# Altium project system-schematic.PrjPcb
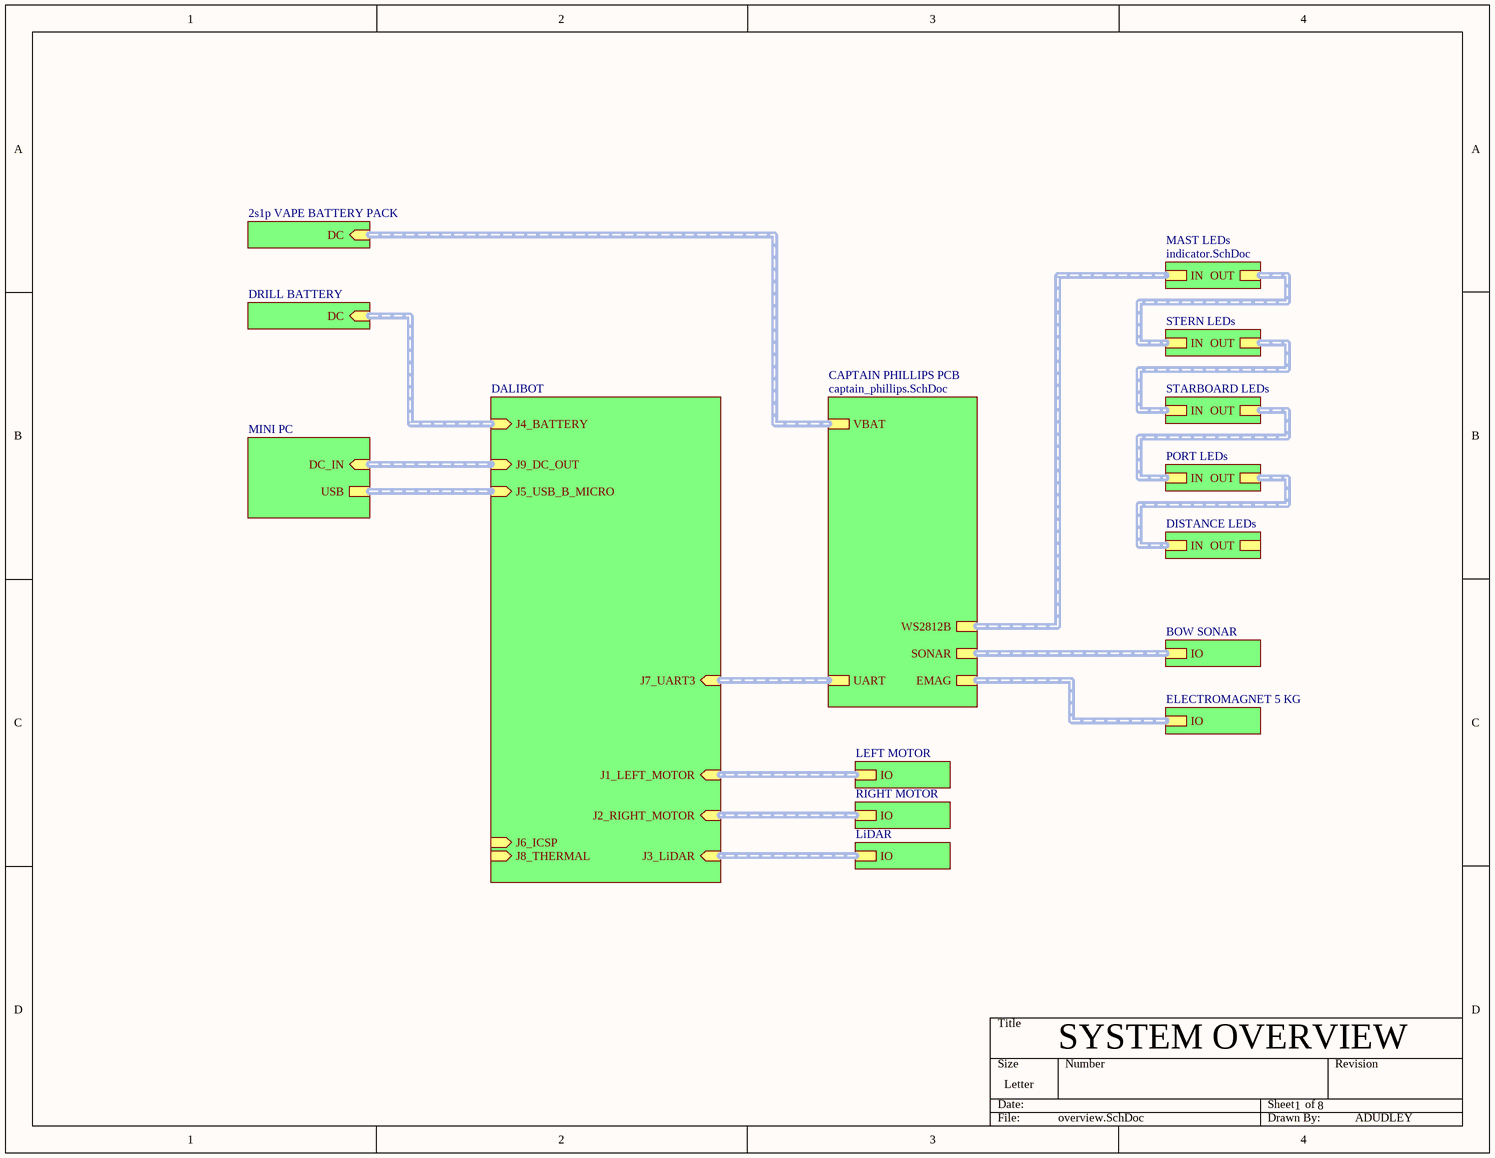
[diagram p0: overview.SchDoc]
8 sheets, 73 parts. Net scope: hierarchical (ports join the sheet entries above them; power ports are global).
Sheets:
  overview.SchDoc
    MAST LEDs = indicator.SchDoc
    PORT LEDs = indicator.SchDoc
    STERN LEDs = indicator.SchDoc
    STARBOARD LEDs = indicator.SchDoc
    CAPTAIN PHILLIPS PCB = captain_phillips.SchDoc
      PSU = power_supply.SchDoc
      MICROCONTROLLER = microcontroller.SchDoc
      EMAG CONTROL = emag.SchDoc
      WS2812B CONTROL = ws2812b.SchDoc
      SONAR CONTROL = sonar.SchDoc
    DISTANCE LEDs = indicator.SchDoc

## Sheet overview.SchDoc
size Letter; SheetNumber: 1; SheetTotal: 8

### Sub-sheets
2s1p VAPE BATTERY PACK = File Name (file not in this document): DC (in)
BOW SONAR = File Name (file not in this document): IO
CAPTAIN PHILLIPS PCB = captain_phillips.SchDoc: SONAR, UART, WS2812B, EMAG, VBAT
DALIBOT = File Name (file not in this document): J1_LEFT_MOTOR (in), J2_RIGHT_MOTOR (in), J3_LiDAR (in), J4_BATTERY (in), J5_USB_B_MICRO (in), J6_ICSP (in), J7_UART3 (in), J8_THERMAL (in), J9_DC_OUT (in)
DISTANCE LEDs = indicator.SchDoc: OUT, IN
DRILL BATTERY = File Name (file not in this document): DC (in)
ELECTROMAGNET 5 KG = File Name (file not in this document): IO
LEFT MOTOR = File Name (file not in this document): IO
LiDAR = File Name (file not in this document): IO
MAST LEDs = indicator.SchDoc: IN, OUT
MINI PC = File Name (file not in this document): USB, DC_IN (in)
PORT LEDs = indicator.SchDoc: OUT, IN
RIGHT MOTOR = File Name (file not in this document): IO
STARBOARD LEDs = indicator.SchDoc: OUT, IN
STERN LEDs = indicator.SchDoc: OUT, IN

### Buses and harness runs
harness sheet 2s1p VAPE BATTERY PACK/DC = sheet CAPTAIN PHILLIPS PCB/VBAT
harness sheet BOW SONAR/IO = sheet CAPTAIN PHILLIPS PCB/SONAR
harness sheet CAPTAIN PHILLIPS PCB/EMAG = sheet ELECTROMAGNET 5 KG/IO
harness sheet CAPTAIN PHILLIPS PCB/UART = sheet DALIBOT/J7_UART3
harness sheet CAPTAIN PHILLIPS PCB/WS2812B = sheet MAST LEDs/IN
harness sheet DALIBOT/J1_LEFT_MOTOR = sheet LEFT MOTOR/IO
harness sheet DALIBOT/J2_RIGHT_MOTOR = sheet RIGHT MOTOR/IO
harness sheet DALIBOT/J3_LiDAR = sheet LiDAR/IO
harness sheet DALIBOT/J4_BATTERY = sheet DRILL BATTERY/DC
harness sheet DALIBOT/J5_USB_B_MICRO = sheet MINI PC/USB
harness sheet DALIBOT/J9_DC_OUT = sheet MINI PC/DC_IN
harness sheet DISTANCE LEDs/IN = sheet PORT LEDs/OUT
harness sheet MAST LEDs/OUT = sheet STERN LEDs/IN
harness sheet PORT LEDs/IN = sheet STARBOARD LEDs/OUT
harness sheet STARBOARD LEDs/IN = sheet STERN LEDs/OUT

### Notes on the sheet
- SYSTEM OVERVIEW
- ADUDLEY

## Sheet indicator.SchDoc
size Letter; SheetNumber: 8; SheetTotal: 8
Used 5 times, as channels MAST LEDs, PORT LEDs, STERN LEDs, STARBOARD LEDs, DISTANCE LEDs. Parts and nets are listed once, with the designators drawn on the sheet.
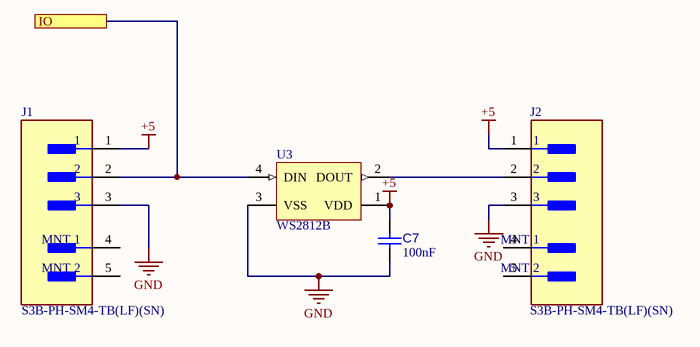
[diagram p1: indicator.SchDoc]

### Parts
C7  value 100nF  [3]  (hidden comment: Capacitor 100 nF 10 % 50V 0603)
J1  S3B-PH-SM4-TB(LF)(SN)  [FP-S3B-PH-SM4-TB_LF_SN-MFG]
J2  S3B-PH-SM4-TB(LF)(SN)  [FP-S3B-PH-SM4-TB_LF_SN-MFG]
U3  WS2812B  [ADAI-WS2812B_V]

### Ports
IO

### Nets
+5: C7.2 J1.1 J2.1 U3.1(VDD)
GND: C7.1 J1.3 J2.3 U3.3(VSS)
IO: J1.2 U3.4(DIN) ; port IO
NetJ2_2: J2.2 U3.2(DOUT)

Not connected (* = marked no-connect by the designer): J1 4(MNT_1) 5(MNT_2); J2 4(MNT_1) 5(MNT_2)

### Channels
MAST LEDs: designators end in _MAST_LEDs; ports IO=NetJ1_MAST_LEDs_2
PORT LEDs: designators end in _PORT_LEDs; ports IO=NetJ1_PORT_LEDs_2
STERN LEDs: designators end in _STERN_LEDs; ports IO=NetJ1_STERN_LEDs_2
STARBOARD LEDs: designators end in _STARBOARD_LEDs; ports IO=NetJ1_STARBOARD_LEDs_2
DISTANCE LEDs: designators end in _DISTANCE_LEDs; ports IO=NetJ1_DISTANCE_LEDs_2

### Library data of the parts
C7 = CMP-001-00092-5: CAP CER 100 nF 50V X7R 0603; Capacitor Type: Ceramic; Tolerance: 10%; Voltage Rating: 50V; Case/Package: 0603; LCSC Part Number: C14663
J1 J2 = CMP-2000-07023-2: CONN HEADER SMD R/A 3POS 2MM; Voltage Rating: 100V; Gender: Male; Max Current Rating: 2A; Number of Contacts: 3; Insulation Resistance: 1GR; Contact Resistance: 10mR; Termination: Solder; Orientation: Right Angle; Insulation Color: Natural; Flammability Rating: UL94 V-0; Width: 5mm; Lead Free: Lead Free; Mount: Surface Mount; Max Operating Temperature: 85°C; Connector Type: Header; Fastening Type: Detent; Max Voltage Rating (DC): 100V; Housing Material: Polyamide; Number of Rows: 1; Housing Color: Beige; Contact Plating: Tin; Contact Shape: Square; Working Voltage: 100V; Contact Material: Copper Alloy; Contact Mating Length: 0.13inch; Contact Type: Male Pin; Max Voltage Rating (AC): 100V; Packaging: Tape and Reel; Min Operating Temperature: -25°C; Number of Positions: 3; REACH SVHC: No SVHC; Contact Finish - Mating: TIN; Color: Natural; Length: 9.9mm; Insulation Material: Nylon; Depth: 7.6mm; Current Rating: 2A; Material: Polyamide; Voltage Rating (AC): 100V; Pitch: 2mm; Series: PH; Height: 9.4mm; Number of Poles: 3; Lead Pitch: 2mm
U3 = CMP-007-00035-2: Intelligent Control LED Integrated Light Source, 3.5 to 5.3 V, -25 to 80 degC, 4-Pin SMD, RoHS, Bulk; Manufacturer: Adafruit Industries; Datasheet URL: https://cdn-shop.adafruit.com/datasheets/WS2812B.pdf; Manufacturer URL: https://www.adafruit.com/; Datasheet Version: May-13; Case/Package: WS2812B; Mounting Technology: SM; RoHS Compliant: False; Package Description: 4-Pin Surface Mount Device, Body 5 x 5 mm, Pitch 3.3 mm; Package Reference: WS2812B

## Sheet captain_phillips.SchDoc
size Letter; SheetNumber: 2; SheetTotal: 8
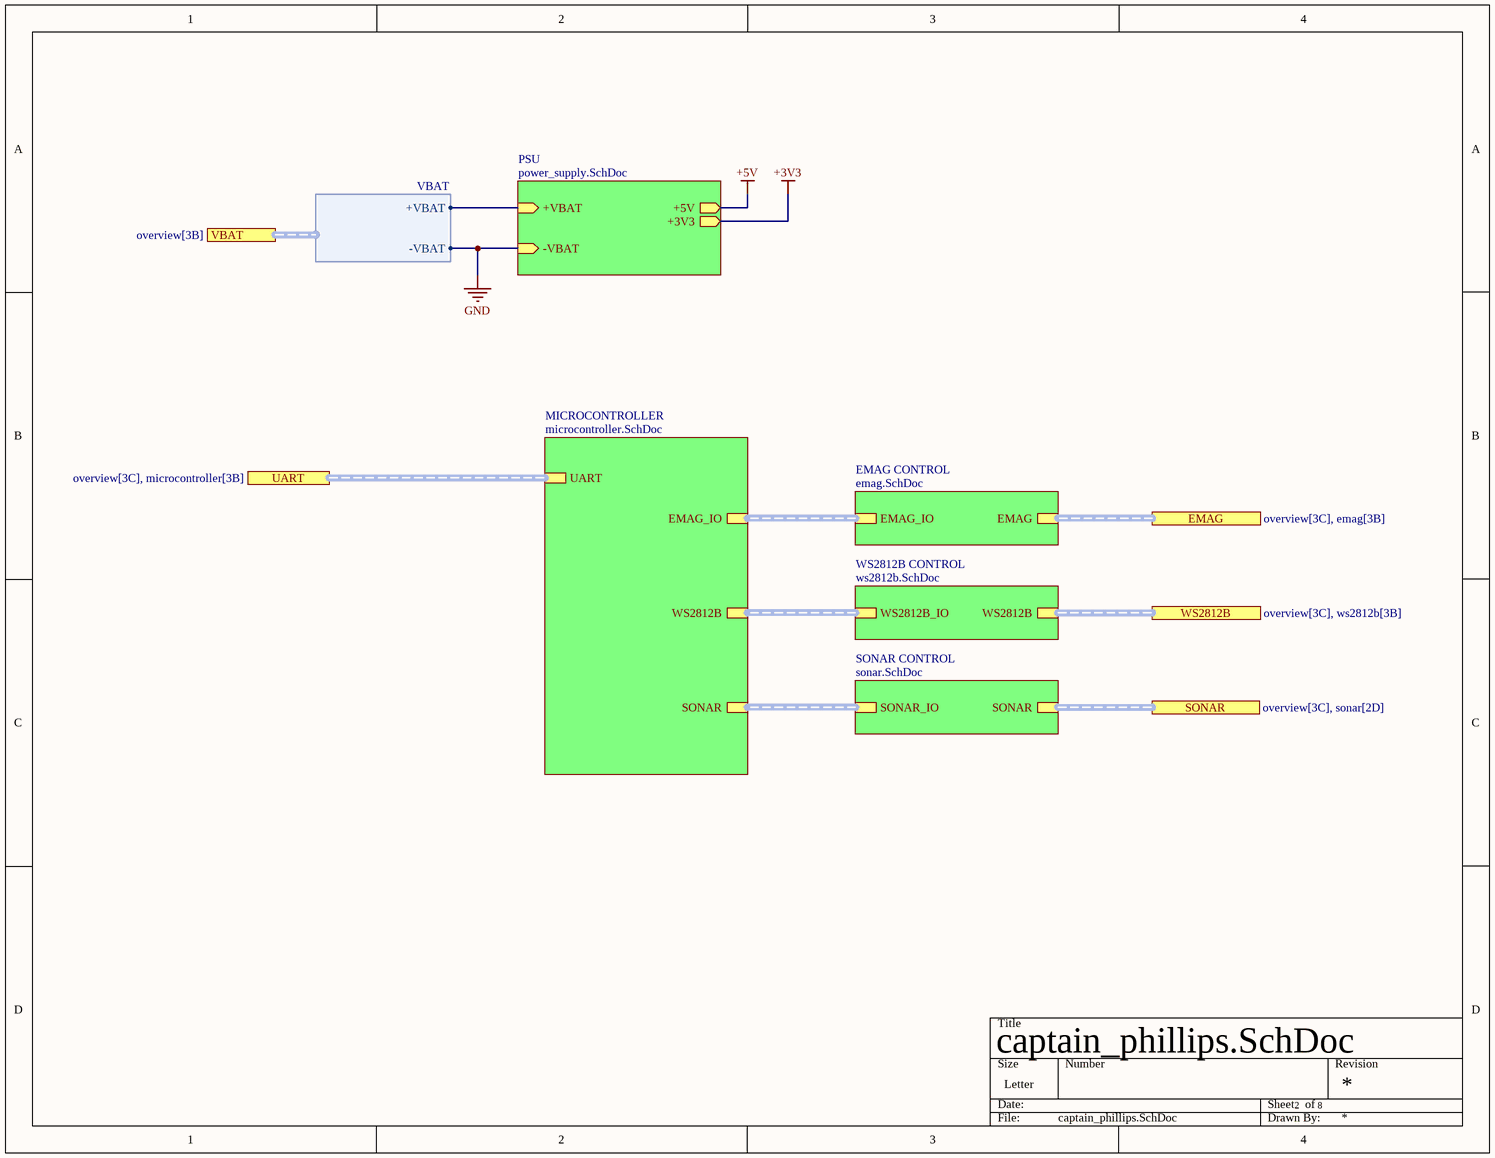
[diagram p2: captain_phillips.SchDoc]

### Sub-sheets
EMAG CONTROL = emag.SchDoc: EMAG, EMAG_IO
MICROCONTROLLER = microcontroller.SchDoc: UART, SONAR, WS2812B, EMAG_IO
PSU = power_supply.SchDoc: +VBAT (in), -VBAT (in), +5V (out), +3V3 (out)
SONAR CONTROL = sonar.SchDoc: SONAR_IO, SONAR
WS2812B CONTROL = ws2812b.SchDoc: WS2812B_IO, WS2812B

### Ports
EMAG (see overview[3C], emag[3B]), SONAR (see overview[3C], sonar[2D]), UART (see overview[3C], microcontroller[3B]), VBAT (harness VBAT, see overview[3B]), WS2812B (see overview[3C], ws2812b[3B])

### Harnesses
VBAT: +VBAT, -VBAT

### Nets
GND: sheet PSU/-VBAT, port VBAT.-VBAT
NetC?#2_2: sheet PSU/+VBAT, port VBAT.+VBAT

### Buses and harness runs
harness port EMAG = sheet EMAG CONTROL/EMAG
harness port SONAR = sheet SONAR CONTROL/SONAR
harness port UART = sheet MICROCONTROLLER/UART
harness port WS2812B = sheet WS2812B CONTROL/WS2812B
harness sheet EMAG CONTROL/EMAG_IO = sheet MICROCONTROLLER/EMAG_IO
harness sheet MICROCONTROLLER/SONAR = sheet SONAR CONTROL/SONAR_IO
harness sheet MICROCONTROLLER/WS2812B = sheet WS2812B CONTROL/WS2812B_IO

## Sheet power_supply.SchDoc
size Letter; SheetNumber: 3; SheetTotal: 8
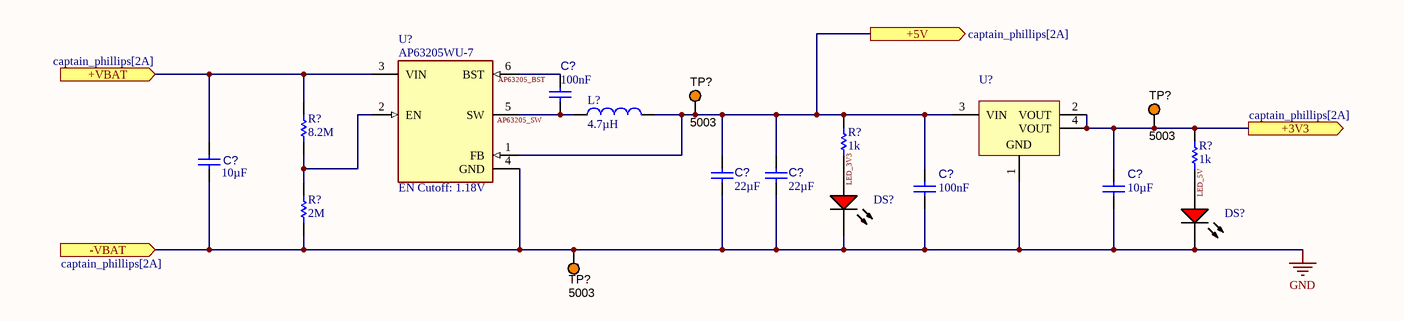
[diagram p3: power_supply.SchDoc]

### Parts
(Parts that share a designator on the sheet are numbered #1, #2 ... from top to bottom, then left to right.)
C?#1  value 100nF  [CAPC1005X05M]  (hidden comment: Capacitor 100nF 10 % 50V 0402)
C?#2  value 10µF  [3]  (hidden comment: Capacitor 10 uF 20 % 25V 0603)
C?#3  value 22µF  [3]  (hidden comment: Capacitor 22 uF 20 % 10V 0603)
C?#4  value 22µF  [3]  (hidden comment: Capacitor 22 uF 20 % 10V 0603)
C?#5  value 100nF  [3]  (hidden comment: Capacitor 100 nF 10 % 50V 0603)
C?#6  value 10µF  [3]  (hidden comment: Capacitor 10 uF 20 % 25V 0603)
DS?#1  19-217/R6C-AL1M2VY/3T  [EVRL-0603-2_V]  (value not drawn)
DS?#2  19-217/R6C-AL1M2VY/3T  [EVRL-0603-2_V]  (value not drawn)
L?  value 4.7µH  [FP-SPM6530-0]  (hidden comment: SPM6530T-4R7M-HZ)
R?#1  value 1k  [RESC1608X55X25ML10T15]  (hidden comment: 1K 1% 0603)
R?#2  value 8.2M  [RESC1608X55X25ML10T15]  (hidden comment: 8M2 1 0603)
R?#3  value 1k  [RESC1608X55X25ML10T15]  (hidden comment: 1K 1% 0603)
R?#4  value 2M  [RESC1608X55X25ML10T15]  (hidden comment: 2M 1 0603)
TP?#1  5003  [KSTN-5003]
TP?#2  5003  [KSTN-5003]
TP?#3  5003  [KSTN-5003]
U?#1  AP63205WU-7  [FP-TSOT26-MFG]
U?#2  LDL1117S33R  [STM-SOT-223_M]  (value not drawn)

### Ports
+3V3 (out, see captain_phillips[2A]), +5V (out, see captain_phillips[2A]), +VBAT (in, see captain_phillips[2A]), -VBAT (in, see captain_phillips[2A])

### Nets
+3V3: C?#6.2 R?#3.1 TP?#2.1 U?#2.2(VOUT) U?#2.4(VOUT) ; port +3V3
+5V: C?#3.2 C?#4.2 C?#5.2 L?.2 R?#1.1 TP?#1.1 U?#1.1(FB) U?#2.3(VIN) ; port +5V
GND: C?#2.1 C?#3.1 C?#4.1 C?#5.1 C?#6.1 DS?#1.2(K) DS?#2.2(K) R?#4.1 TP?#3.1 U?#1.4(GND) U?#2.1(GND) ; port -VBAT
AP63205_BST: C?#1.2 U?#1.6(BST)
AP63205_SW: C?#1.1 L?.1 U?#1.5(SW)
LED_3V3: DS?#1.1(A) R?#1.2
LED_5V: DS?#2.1(A) R?#3.2
NetC?#2_2: C?#2.2 R?#2.2 U?#1.3(VIN) ; port +VBAT
NetR?#2_1: R?#2.1 R?#4.2 U?#1.2(EN)

### Notes on the sheet
- (near U?#1) EN Cutoff: 1.18V

### Library data of the parts
C?#1 = CMP-001-00135-7: CAP CER 100nF 25V X7R 0402; Tolerance: 10%; Capacitor Type: Ceramic; Voltage Rating: 25V; Mounting Technology: Surface Mount; Case/Package: 0402; Max Operating Temperature: 125°C; RoHS Compliant: Yes; Min Operating Temperature: -55°C; Pins: 2; LCSC Part Number: C307331
C?#2 C?#6 = CMP-001-00101-3: CAP CER 10UF 25V X5R 0603; Capacitor Type: Ceramic; Tolerance: 20%; Case/Package: 0603; Voltage Rating: 25V; LCSC Part Number: C96446
C?#3 C?#4 = CMP-001-00128-4: CAP CER 22UF 10V X5R 0603; Tolerance: 20%; Capacitor Type: Ceramic; Mounting Technology: Surface Mount; Voltage Rating: 10V; Max Operating Temperature: 85°C; Min Operating Temperature: -55°C; Pins: 2; RoHS Compliant: Yes; Case/Package: 0603; LCSC Part Number: C59461
C?#5 = CMP-001-00092-5: CAP CER 100 nF 50V X7R 0603; Tolerance: 10%; Capacitor Type: Ceramic; Voltage Rating: 50V; Case/Package: 0603; LCSC Part Number: C14663
DS?#1 DS?#2 = CMP-007-00004-3: Chip LED, Red, 5 V, 25 mA, -40 to 85 degC, 2-Pin SMD (0603), RoHS, Tape and Reel; Manufacturer: Everlight Electronics; Forward Voltage: 2.2V; Lens Style: Clear; Package Reference: 0603; Datasheet Version: Rev. 1, 01/2005; Mounting Technology: SM; RoHS Compliant: False; Datasheet URL: https://datasheet.ciiva.com/4688/el-19-217-r6c-al1m2vy-3tpdf-187026-4688713.pdf; Case/Package: 0603; Colour: Red; Manufacturer URL: http://www.everlight.com/; Package Description: 2-Pin Surface Mount Device, Body 1.6 x 0.8 mm; LCSC Part Number: C2286
L? = CMP-006-00027-2: General Purpose Inductor, 4.7uH, 20%, 1 Element, Metal-Core, SMD, 2826; Max Current Rating: 5.6A; RoHS Compliant: Yes; Case/Package: SPM6530T-4R7M-HZ; Inductor Type: GENERAL PURPOSE INDUCTOR; LCSC Part Number: C360729
R?#1 R?#3 = CMP-0103-0583-9: 0603 (1608 Metric) 1/10 W 1K 1% Thick Film Chip Resistor; Case-Metric: 1608; Power: 100mW; Case-EIA: 0603; Temp. Coefficent: ±100; Technology: SMT; Tolerance: 1%; Case/Package: 0603; LCSC Part Number: C21190
R?#2 = CMP-0103-0677-7: 0603 (1608 Metric) 1/10 W 8M2 1 Thick Film Chip Resistor; Power: 100mW; Temp. Coefficent: ±100; Tolerance: 1%; Case-Metric: 1608; Case-EIA: 0603; Technology: SMT
R?#4 = CMP-0103-0662-7: 0603 (1608 Metric) 1/10 W 2M 1 Thick Film Chip Resistor; Case-Metric: 1608; Case-EIA: 0603; Power: 100mW; Tolerance: 1%; Temp. Coefficent: ±100; Technology: SMT
TP?#1-TP?#3 = CMP-002-00037-3: Test Point, Orange, Height 4.6 mm, Tail Length 3 mm, 1-Pin THD, RoHS; Manufacturer: Keystone; Case/Package: 5003; RoHS Compliant: True; Mounting Technology: TH; Connector Type: TestPoint; Pins: 1; Colour: Orange; Packaging: Bulk; Package Description: 1-Pin Through Hole Device, Dia 2.54 mm; Package Reference: 5003; Datasheet Version: Jun-15; Diameter: 2.54mm; Contact Material: Bronze; Datasheet URL: http://keyelco.com/userAssets/file/M65p56.pdf; Manufacturer URL: http://www.keyelco.com/; Package Quantity: 10; Contact Plating: Tin; LCSC Part Number: C238122
U?#1 = CMP-019-00057-2: Switching Regulator; LCSC Part Number: C2071056
U?#2 = CMP-019-00076-2: Fixed Positive LDO Regulator, 3.3V, 0.6V Dropout, PDSO4; Manufacturer: STMicroelectronics; Output Current: 950mA; Output Voltage1-Max: 3.399V; Output Current1-Max: 1.2A; Number of Outputs: 1; Max Input Voltage: 15V; Time @ Peak Reflow Temperature-Max (s): 30s; Min Input Voltage: 4.3V; Max Supply Voltage: 18V; Dropout Voltage1-Nom: 1.1V; Power: 12W; Output Voltage1-Min: 3.201V; Max Ouput Current: 1.3A; Regulator Type: FIXED POSITIVE SINGLE OUTPUT LDO REGULATOR; Qualification Status: Not Qualified; Dropout Voltage1-Max: 600mV; Min Supply Voltage: 4.75V; Voltage Tolerance-Max: 2%; Package Body Material: Plastic; Technology: BIPOLAR; Mounting Technology: SM; Reach SVHC Compliant: Yes; Package Quantity: 2500; Channels: 1; Max Operating Temperature: 125°C; Output Voltage: 3.3V; Terminal Finish: Tin; Terminal Pitch: 2.3mm; Operating Temperature, TJ-Min: -40°C; Surface Mount: Yes; Moisture Sensitivity Level: 1; Peak Reflow Temperature (Cel): 260°C; Datasheet URL: http://www.farnell.com/datasheets/1776449.pdf; RoHS Compliant: Yes; Terminal Form: Gull Wing; Width: 3.5mm; Height - Seated (Max): 1.9mm; Operating Temperature, TJ-Max: 125°C; Length: 6.5mm; Package Description: 4-Pin Small Outline Transistor, Body 6.5 x 3.5 mm, Pitch 2.3 mm; Output Voltage1-Nom: 3.3V; Package Style: SMALL OUTLINEMeter; Dropout Voltage: 1.1V; Outputs: 1; JESD-609 Code: e3; Manufacturer URL: http://www.st.com/; Datasheet Version: Rev. 33, 11/2013; Package Shape: Rectangular; Package Reference: SOT-223; JESD-30 Code: R-PDSO-G4; Packaging: Tape and Reel; Input Voltage Absolute-Max: 15V; Pins: 4; Adjustability: FIXED; Nominal Output Voltage: 3.3V; Min Operating Temperature: 0°C; Case/Package: SOP; Terminal Position: DUAL; LCSC Part Number: C435835

## Sheet microcontroller.SchDoc
size Letter; SheetNumber: 7; SheetTotal: 8
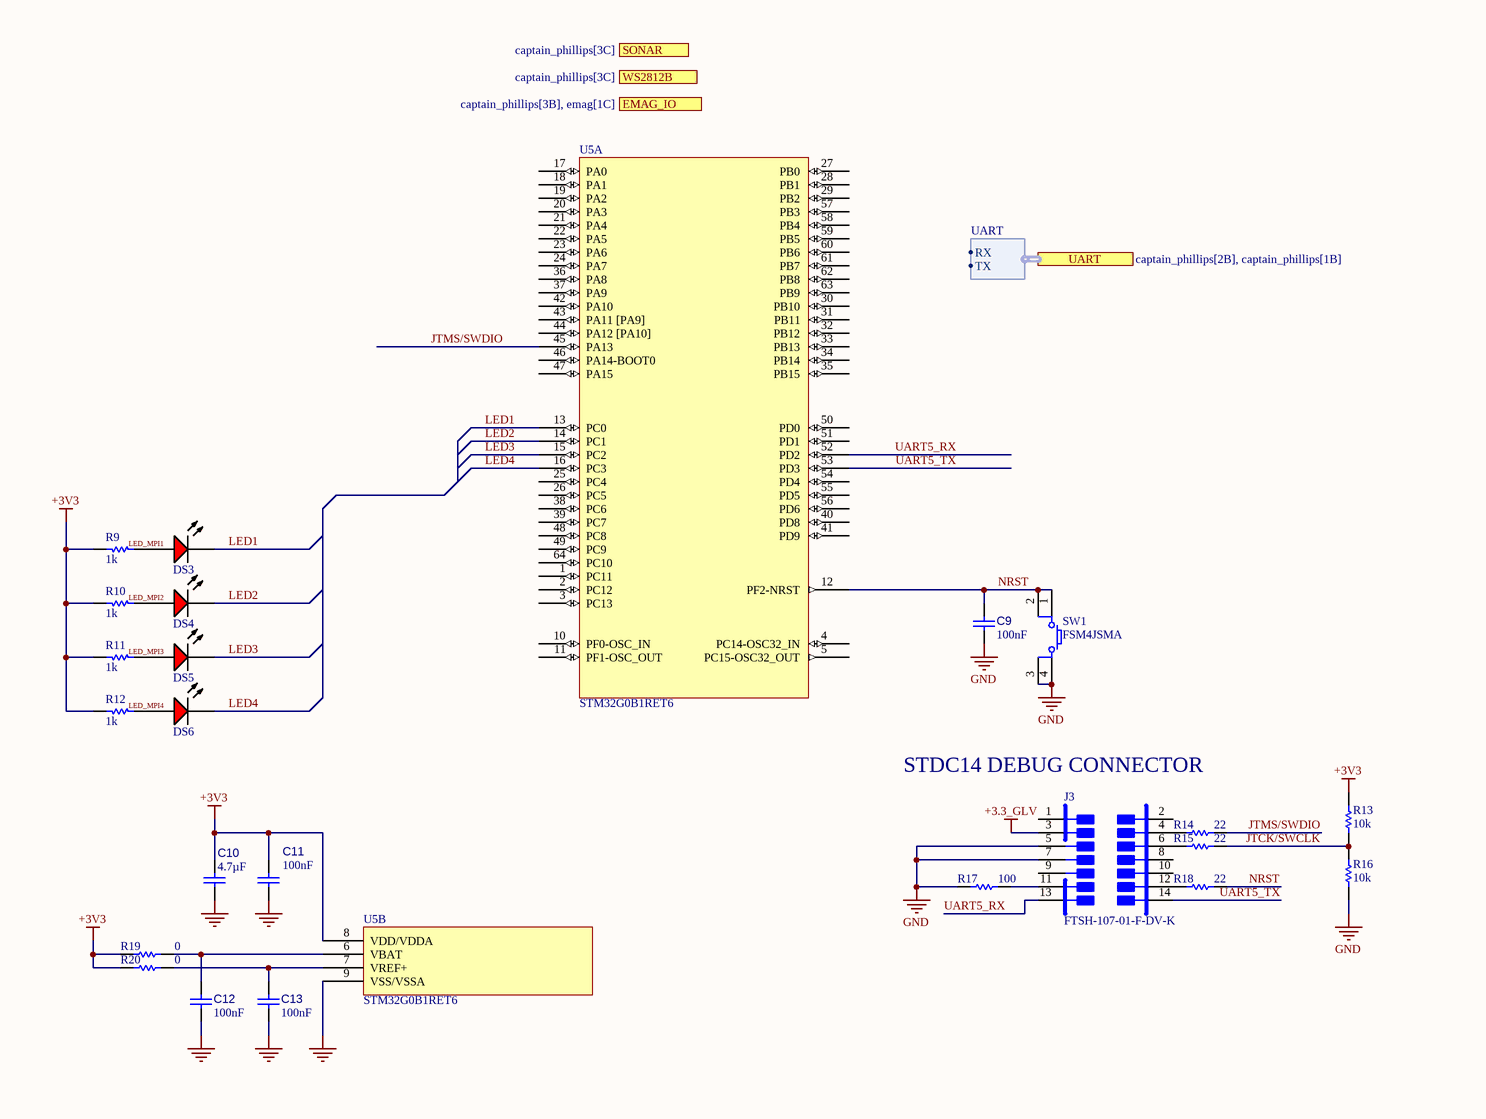
[diagram p4: microcontroller.SchDoc, left]
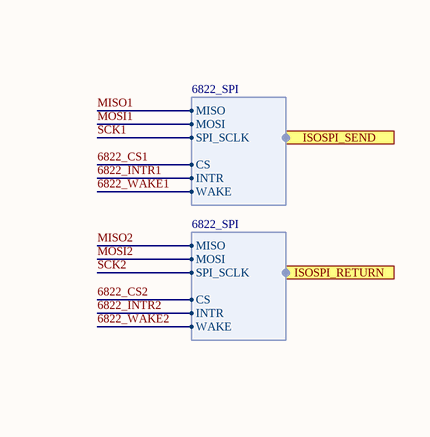
[diagram p5: microcontroller.SchDoc, right]

### Parts
C9  value 100nF  [CAPC1005X05M]  (hidden comment: Capacitor 100nF 10 % 50V 0402)
C10  value 4.7µF  [CAPC1005X05M]  (hidden comment: Capacitor 4.7uF 20 % 10V 0402)
C11  value 100nF  [CAPC1005X05M]  (hidden comment: Capacitor 100nF 10 % 50V 0402)
C12  value 100nF  [CAPC1005X05M]  (hidden comment: Capacitor 100nF 10 % 50V 0402)
C13  value 100nF  [CAPC1005X05M]  (hidden comment: Capacitor 100nF 10 % 50V 0402)
DS3  19-217/R6C-AL1M2VY/3T  [EVRL-0603-2_V]  (value not drawn)
DS4  19-217/R6C-AL1M2VY/3T  [EVRL-0603-2_V]  (value not drawn)
DS5  19-217/R6C-AL1M2VY/3T  [EVRL-0603-2_V]  (value not drawn)
DS6  19-217/R6C-AL1M2VY/3T  [EVRL-0603-2_V]  (value not drawn)
J3  FTSH-107-01-F-DV-K  [FP-FTSH-107-01-F-DV-K-MFG]
R9  value 1k  [RESC1608X55X25ML10T15]  (hidden comment: 1K 1% 0603)
R10  value 1k  [RESC1608X55X25ML10T15]  (hidden comment: 1K 1% 0603)
R11  value 1k  [RESC1608X55X25ML10T15]  (hidden comment: 1K 1% 0603)
R12  value 1k  [RESC1608X55X25ML10T15]  (hidden comment: 1K 1% 0603)
R13  value 10k  [RESC1608X55X25ML10T15]  (hidden comment: 10K 1 0603)
R14  value 22  [RESC1608X55X25ML10T15]  (hidden comment: 22R 1% 0603)
R15  value 22  [RESC1608X55X25ML10T15]  (hidden comment: 22R 1% 0603)
R16  value 10k  [RESC1608X55X25ML10T15]  (hidden comment: 10K 1 0603)
R17  value 100  [RESC1608X55X25ML10T15]  (hidden comment: 100R 1 0603)
R18  value 22  [RESC1608X55X25ML10T15]  (hidden comment: 22R 1% 0603)
R19  value 0  [RESC1608X55X25ML10T15]  (hidden comment: Jumper 0603)
R20  value 0  [RESC1608X55X25ML10T15]  (hidden comment: Jumper 0603)
SW1  FSM4JSMA  [TECO-FSM4JSMA_V]
U5  STM32G0B1RET6  [STM32G0B1RET6-Footprint-1]  (parts A,B of 2)

### Ports
EMAG_IO (see captain_phillips[3B], emag[1C]), ISOSPI_RETURN (harness 6822_SPI), ISOSPI_SEND (harness 6822_SPI), SONAR (see captain_phillips[3C]), UART (harness UART, see captain_phillips[2B], captain_phillips[1B]), WS2812B (see captain_phillips[3C])

### Harnesses
UART: RX, TX
6822_SPI: MISO, MOSI, SPI_SCLK, CS, INTR, WAKE

### Nets
+3.3_GLV: J3.3
+3V3: C10.2 C11.1 R9.2 R10.2 R11.2 R12.2 R13.2 R19.1 R20.1 U5.8(VDD/VDDA)
GND: C9.1 C10.1 C11.2 C12.2 C13.2 J3.5 J3.7 R16.1 R17.1 SW1.3 SW1.4 U5.9(VSS/VSSA)
6822_CS1: port ISOSPI_SEND.CS
6822_CS2: port ISOSPI_RETURN.CS
6822_INTR1: port ISOSPI_SEND.INTR
6822_INTR2: port ISOSPI_RETURN.INTR
6822_WAKE1: port ISOSPI_SEND.WAKE
6822_WAKE2: port ISOSPI_RETURN.WAKE
JTCK/SWCLK: R13.1 R15.2 R16.2
JTMS/SWDIO: R14.2 U5.45(PA13)
LED1: DS3.2(K) U5.13(PC0)
LED2: DS4.2(K) U5.14(PC1)
LED3: DS5.2(K) U5.15(PC2)
LED4: DS6.2(K) U5.16(PC3)
LED_MPI1: DS3.1(A) R9.1
LED_MPI2: DS4.1(A) R10.1
LED_MPI3: DS5.1(A) R11.1
LED_MPI4: DS6.1(A) R12.1
MISO1: port ISOSPI_SEND.MISO
MISO2: port ISOSPI_RETURN.MISO
MOSI1: port ISOSPI_SEND.MOSI
MOSI2: port ISOSPI_RETURN.MOSI
NRST: C9.2 R18.2 SW1.1 SW1.2 U5.12(PF2-NRST)
SCK1: port ISOSPI_SEND.SPI_SCLK
SCK2: port ISOSPI_RETURN.SPI_SCLK
UART5_RX: J3.13 U5.52(PD2)
UART5_TX: J3.14 U5.53(PD3)
NetC12_1: C12.1 R19.2 U5.6(VBAT)
NetC13_1: C13.1 R20.2 U5.7(VREF+)
NetJ3_4: J3.4 R14.1
NetJ3_6: J3.6 R15.1
NetJ3_11: J3.11 R17.2
NetJ3_12: J3.12 R18.1

Not connected (* = marked no-connect by the designer): J3 1 2 8 9 10; U5 1(PC11) 2(PC12) 3(PC13) 4(PC14-OSC32_IN) 5(PC15-OSC32_OUT) 10(PF0-OSC_IN) 11(PF1-OSC_OUT) 17(PA0) 18(PA1) 19(PA2) 20(PA3) 21(PA4) 22(PA5) 23(PA6) 24(PA7) 25(PC4) 26(PC5) 27(PB0) 28(PB1) 29(PB2) 30(PB10) 31(PB11) 32(PB12) 33(PB13) 34(PB14) 35(PB15) 36(PA8) 37(PA9) 38(PC6) 39(PC7) 40(PD8) 41(PD9) 42(PA10) 43(PA11_[PA9]) 44(PA12_[PA10]) 46(PA14-BOOT0) 47(PA15) 48(PC8) 49(PC9) 50(PD0) 51(PD1) 54(PD4) 55(PD5) 56(PD6) 57(PB3) 58(PB4) 59(PB5) 60(PB6) 61(PB7) 62(PB8) 63(PB9) 64(PC10)

### Notes on the sheet
- (near J3) STDC14 DEBUG CONNECTOR

### Library data of the parts
C9 C11-C13 = CMP-001-00135-7: as C?#1 on sheet power_supply; Case/Package: 0402; Pins: 2; Min Operating Temperature: -55°C; RoHS Compliant: Yes; Mounting Technology: Surface Mount; Max Operating Temperature: 125°C; Voltage Rating: 25V; LCSC Part Number: C307331
C10 = CMP-001-00134-4: CAP CER 4.7uF 10V X7R 0402; Capacitor Type: Ceramic; Tolerance: 20%; Mounting Technology: Surface Mount; Case/Package: 0402; Voltage Rating: 10V; Pins: 2; Min Operating Temperature: -55°C; RoHS Compliant: Yes; Max Operating Temperature: 85°C; LCSC Part Number: C23733
DS3-DS6 = CMP-007-00004-3: as DS?#1 on sheet power_supply; Package Reference: 0603; Datasheet Version: Rev. 1, 01/2005; Mounting Technology: SM; RoHS Compliant: False; Datasheet URL: https://datasheet.ciiva.com/4688/el-19-217-r6c-al1m2vy-3tpdf-187026-4688713.pdf; Case/Package: 0603; Colour: Red; Manufacturer URL: http://www.everlight.com/; Package Description: 2-Pin Surface Mount Device, Body 1.6 x 0.8 mm; LCSC Part Number: C2286
J3 = CMP-002-00095-4: Board Connector, 14 Contact(s), 2 Row(s), Male, Straight, 0.05 inch Pitch, Surface Mount Terminal, Locking; RoHS Compliant: Yes; Connector Type: BOARD CONNECTOR; Mounting Technology: Board; LCSC Part Number: C7465995
R9-R12 = CMP-0103-0583-9: as R?#1 on sheet power_supply; Technology: SMT; Tolerance: 1%; Case/Package: 0603; LCSC Part Number: C21190
R13 R16 = CMP-0103-0607-9: 0603 (1608 Metric) 1/10 W 10K 1 Thick Film Chip Resistor; Power: 100mW; Tolerance: 1%; Case-EIA: 0603; Temp. Coefficent: ±100; Case-Metric: 1608; Technology: SMT; Case/Package: 0603; LCSC Part Number: C25804
R14 R15 R18 = CMP-0103-0543-9: 0603 (1608 Metric) 1/10 W 22R 1 Thick Film Chip Resistor; Case-Metric: 1608; Case-EIA: 0603; Temp. Coefficent: ±100; Power: 100mW; Tolerance: 1%; Case/Package: 0603; Technology: SMT; LCSC Part Number: C23345
R17 = CMP-0103-0559-8: 0603 (1608 Metric) 1/10 W 100R 1 Thick Film Chip Resistor; Power: 100mW; Temp. Coefficent: ±100; Tolerance: 1%; Case-Metric: 1608; Case-EIA: 0603; Technology: SMT; Case/Package: 0603; LCSC Part Number: C22775
R19 R20 = CMP-0103-0510-7: Jumper 0603 (1608 Metric); Power: 100mW; Tolerance: 0%; Case-Metric: 1608; Case-EIA: 0603; Temp. Coefficent: None; Case/Package: 0603; Technology: SMT; LCSC Part Number: C21189
SW1 = CMP-00028-00007-2: Switch Tactile OFF (ON) SPST Round Button Gull Wing 0.05A 12VDC 1.57N SMD Loose Piece; Voltage Rating: 24V; Max Current Rating: 50mA; Case/Package: SMD/SMT; Mounting Technology: Surface Mount
U5 = CMP-020-00026-3: RISC Microcontroller, 32-Bit, FLASH, Cortex-M0+ CPU, 64MHz, CMOS, PQFP64; LCSC Part Number: C2829307

## Sheet emag.SchDoc
size Letter; SheetNumber: 4; SheetTotal: 8
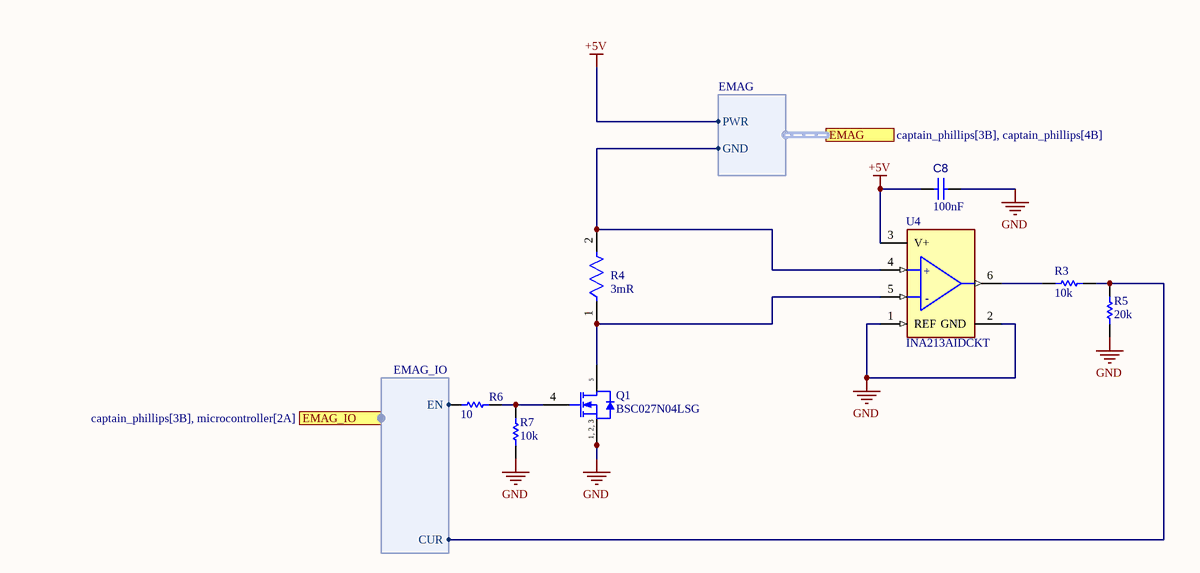
[diagram p6: emag.SchDoc]

### Parts
C8  value 100nF  [3]  (hidden comment: Capacitor 100 nF 10 % 50V 0603)
Q1  BSC027N04LSG  [INF-PG-TDSON-8-1_V]
R3  value 10k  [RESC1608X55X25ML10T15]  (hidden comment: 10K 1 0603)
R4  Resistance: 3mR  [FP-CRE2512-R001-R004-MFG]  (hidden comment: CRE2512-FZ-R003E-3)
R5  value 20k  [RESC1608X55X25ML10T15]  (hidden comment: 20K 1% 0603)
R6  value 10  [RESC1608X55X25ML10T15]  (hidden comment: 10R 1 0603)
R7  value 10k  [RESC1608X55X25ML10T15]  (hidden comment: 10K 1 0603)
U4  INA213AIDCKT  [FP-DCK0006A-MFG]

### Ports
EMAG (harness EMAG, see captain_phillips[3B], captain_phillips[4B]), EMAG_IO (harness EMAG_IO, see captain_phillips[3B], microcontroller[2A])

### Harnesses
EMAG: PWR, GND
EMAG_IO: EN, CUR

### Nets
+5V: C8.1 U4.3(V+) ; port EMAG.PWR
GND: C8.2 Q1.1(SOURCE) Q1.2(SOURCE) Q1.3(SOURCE) R5.1 R7.1 U4.1(REF) U4.2(GND)
NetQ1_4: Q1.4(GATE) R6.2 R7.2
NetQ1_5: Q1.5(DRAIN) R4.1 U4.5(IN-)
NetR3_1: R3.1 R5.2 ; port EMAG_IO.CUR
NetR3_2: R3.2 U4.6(OUT)
NetR4_2: R4.2 U4.4(IN+) ; port EMAG.GND
NetR6_1: R6.1 ; port EMAG_IO.EN

### Notes on the sheet
- (in symbol CMP-013-00042-10) 1, 2, 3
- (in symbol CMP-014-00031-1) +; -

### Library data of the parts
C8 = CMP-001-00092-5: as C7 on sheet indicator; Voltage Rating: 50V; Case/Package: 0603; LCSC Part Number: C14663
Q1 = CMP-013-00042-10: Power Field-Effect Transistor, 24A I(D), 40V, 0.0041ohm, 1-Element, N-Channel, Silicon, Metal-oxide Semiconductor-FET; Operating Mode: ENHANCEMENT MODE; Drain-source On Resistance-Max: 4.1mR; Case Connection: DRAIN; Pulsed Drain Current-Max (IDM): 400A; Power Dissipation-Max (Abs): 83W; Drain Current-Max (Abs) (ID): 100A; DS Breakdown Voltage-Min: 40V; Pins: 5; LCSC Part Number: C2802513; Drain Current-Max (ID): 24A; RoHS Compliant: Yes; Max Operating Temperature: 150°C; FET Technology: METAL-OXIDE SEMICONDUCTOR; Polarity/Channel Type: N-CHANNEL
R3 R7 = CMP-0103-0607-9: 0603 (1608 Metric) 1/10 W 10K 1 Thick Film Chip Resistor; Power: 100mW; Tolerance: 1%; Case-EIA: 0603; Case-Metric: 1608; Temp. Coefficent: ±100; LCSC Part Number: C25804; Technology: SMT; Case/Package: 0603
R4 = CMP-07231-007668-1: RES 0.003 OHM 1% 3W 2512; Temperature Coefficient: 75ppm/°C; Mount: Surface Mount; Max Operating Temperature: 170°C; Min Operating Temperature: -55°C; Technology: METAL STRIP; Series: CRE2512; Case Code (Metric): 6432; Depth: 3.35mm; Case Code (Imperial): 2512; Width: 0.132inch; Case/Package: 2512; Packaging: Cut Tape; REACH SVHC: No SVHC; Resistance Tolerance: 1%; Termination: Solder; Tolerance: 1%; Features: Moisture Resistant; RoHS Compliant: No; Height: 0.035inch; Resistor Type: Metal Alloy; Power Rating: 3W; Number of Terminations: 2; Length: 0.254inch; Contact Plating: Tin; Max Power Dissipation: 3W
R5 = CMP-0103-0614-9: 0603 (1608 Metric) 1/10 W 20K 1 Thick Film Chip Resistor; Case-EIA: 0603; Case-Metric: 1608; Temp. Coefficent: ±100; Power: 100mW; Technology: SMT; Case/Package: 0603; Tolerance: 1%; LCSC Part Number: C4184
R6 = CMP-0103-0535-7: 0603 (1608 Metric) 1/10 W 10R 1 Thick Film Chip Resistor; Temp. Coefficent: ±100; Power: 100mW; Case-EIA: 0603; Tolerance: 1%; Case-Metric: 1608; Technology: SMT
U4 = CMP-014-00031-1: Operational Amplifier, 1 Func, PDSO6; Nominal Supply Voltage: 5V; Min Supply Voltage: 2.7V; Channels: 1; Max Supply Voltage: 26V; Max Operating Temperature: 125°C; Case/Package: TSSOP; RoHS Compliant: Yes; Pins: 6; Min Operating Temperature: -40°C

## Sheet ws2812b.SchDoc
size Letter; SheetNumber: 6; SheetTotal: 8
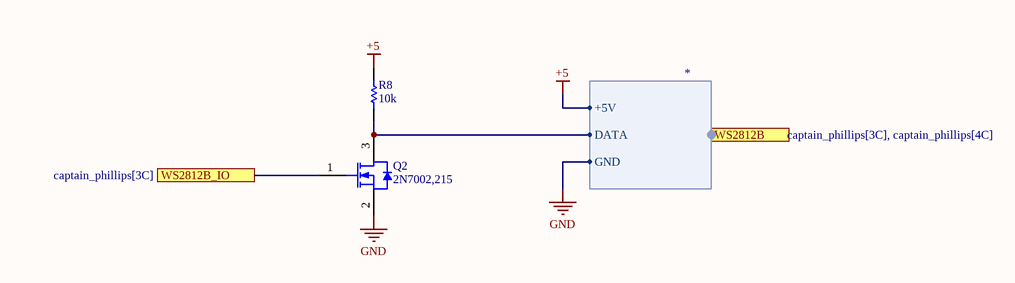
[diagram p7: ws2812b.SchDoc]

### Parts
Q2  2N7002,215  [NXP-SOT23-3_V]
R8  value 10k  [RESC1608X55X25ML10T15]  (hidden comment: 10K 1 0603)

### Ports
WS2812B (harness *, see captain_phillips[3C], captain_phillips[4C]), WS2812B_IO (see captain_phillips[3C])

### Harnesses
*: +5V, DATA, GND

### Nets
+5: R8.2 ; port WS2812B.+5V
GND: Q2.2(S) ; port WS2812B.GND
NetQ2_1: Q2.1(G) ; port WS2812B_IO
NetQ2_3: Q2.3(D) R8.1 ; port WS2812B.DATA

### Library data of the parts
Q2 = CMP-013-00011-5: N-channel Trench MOSFET, 60 V, 300 mA, -65 to 150 degC, 3-Pin SOT-23 (TO-236AB), RoHS, Tape and Reel; Manufacturer: NXP Semiconductors; Input Capacitance: 50pF; Max Dual Supply Voltage: 60V; Power: 830mW; Elements: 1; Package Version: Feb-16; Rds On Max: 5Ohm; Nominal Vgs: 2V; Pins: 8; Max Operating Temperature: 150°C; Package Quantity: 1; LCSC Part Number: C8545; Vds Max: 60V; Package Description: 3-Pin Small Outline Transistor, Body 1.3 x 2.9 mm, Pitch 0.95 mm; Packaging: TapeandReel; Mounting Technology: SM; Datasheet URL: http://www.nxp.com/documents/data_sheet/2N7002.pdf; Case/Package: TO-236-3; Datasheet Version: Rev. 7, 09/2011; Package Reference: SOT23-3; Nominal Dual Supply Voltage: 60V; RoHS Compliant: True; Min Operating Temperature: -65°C
R8 = CMP-0103-0607-9: as R3 on sheet emag; LCSC Part Number: C25804; Technology: SMT; Case/Package: 0603

## Sheet sonar.SchDoc
size Letter; SheetNumber: 5; SheetTotal: 8
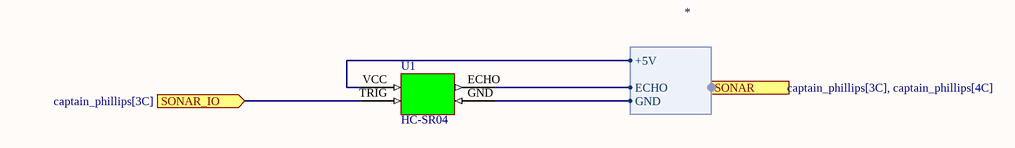
[diagram p8: sonar.SchDoc]

### Parts
U1  HC-SR04  [HC-SR04-Footprint-1]

### Ports
SONAR (harness *, see captain_phillips[3C], captain_phillips[4C]), SONAR_IO (in, see captain_phillips[3C])

### Harnesses
*: +5V, ECHO, GND

### Nets
NetU1_ECHO: U1.ECHO ; port SONAR.ECHO
NetU1_GND: U1.GND ; port SONAR.GND
NetU1_TRIG: U1.TRIG ; port SONAR_IO
NetU1_VCC: U1.VCC ; port SONAR.+5V

### Library data of the parts
U1 = CMP-010-00027-1: Ultrasonic Sensor, 40KHZ, 4.5M Rohs Compliant: No

## Nets that join several sheets
+3V3: power_supply (5 pins), microcontroller (10 pins)
+5: MAST LEDs (C7_MAST_LEDs.2 J1_MAST_LEDs.1 J2_MAST_LEDs.1 U3_MAST_LEDs.1), PORT LEDs (C7_PORT_LEDs.2 J1_PORT_LEDs.1 J2_PORT_LEDs.1 U3_PORT_LEDs.1), STERN LEDs (C7_STERN_LEDs.2 J1_STERN_LEDs.1 J2_STERN_LEDs.1 U3_STERN_LEDs.1), STARBOARD LEDs (C7_STARBOARD_LEDs.2 J1_STARBOARD_LEDs.1 J2_STARBOARD_LEDs.1 U3_STARBOARD_LEDs.1), ws2812b (R8.2), DISTANCE LEDs (C7_DISTANCE_LEDs.2 J1_DISTANCE_LEDs.1 J2_DISTANCE_LEDs.1 U3_DISTANCE_LEDs.1)
+5V: power_supply (8 pins), emag (C8.1 U4.3)
GND: MAST LEDs (C7_MAST_LEDs.1 J1_MAST_LEDs.3 J2_MAST_LEDs.3 U3_MAST_LEDs.3), PORT LEDs (C7_PORT_LEDs.1 J1_PORT_LEDs.3 J2_PORT_LEDs.3 U3_PORT_LEDs.3), STERN LEDs (C7_STERN_LEDs.1 J1_STERN_LEDs.3 J2_STERN_LEDs.3 U3_STERN_LEDs.3), STARBOARD LEDs (C7_STARBOARD_LEDs.1 J1_STARBOARD_LEDs.3 J2_STARBOARD_LEDs.3 U3_STARBOARD_LEDs.3), power_supply (11 pins), microcontroller (12 pins), emag (8 pins), ws2812b (Q2.2), DISTANCE LEDs (C7_DISTANCE_LEDs.1 J1_DISTANCE_LEDs.3 J2_DISTANCE_LEDs.3 U3_DISTANCE_LEDs.3)